# Altium schematic sheet turnRacingMain.SchDoc
size A4; Rules: TODO
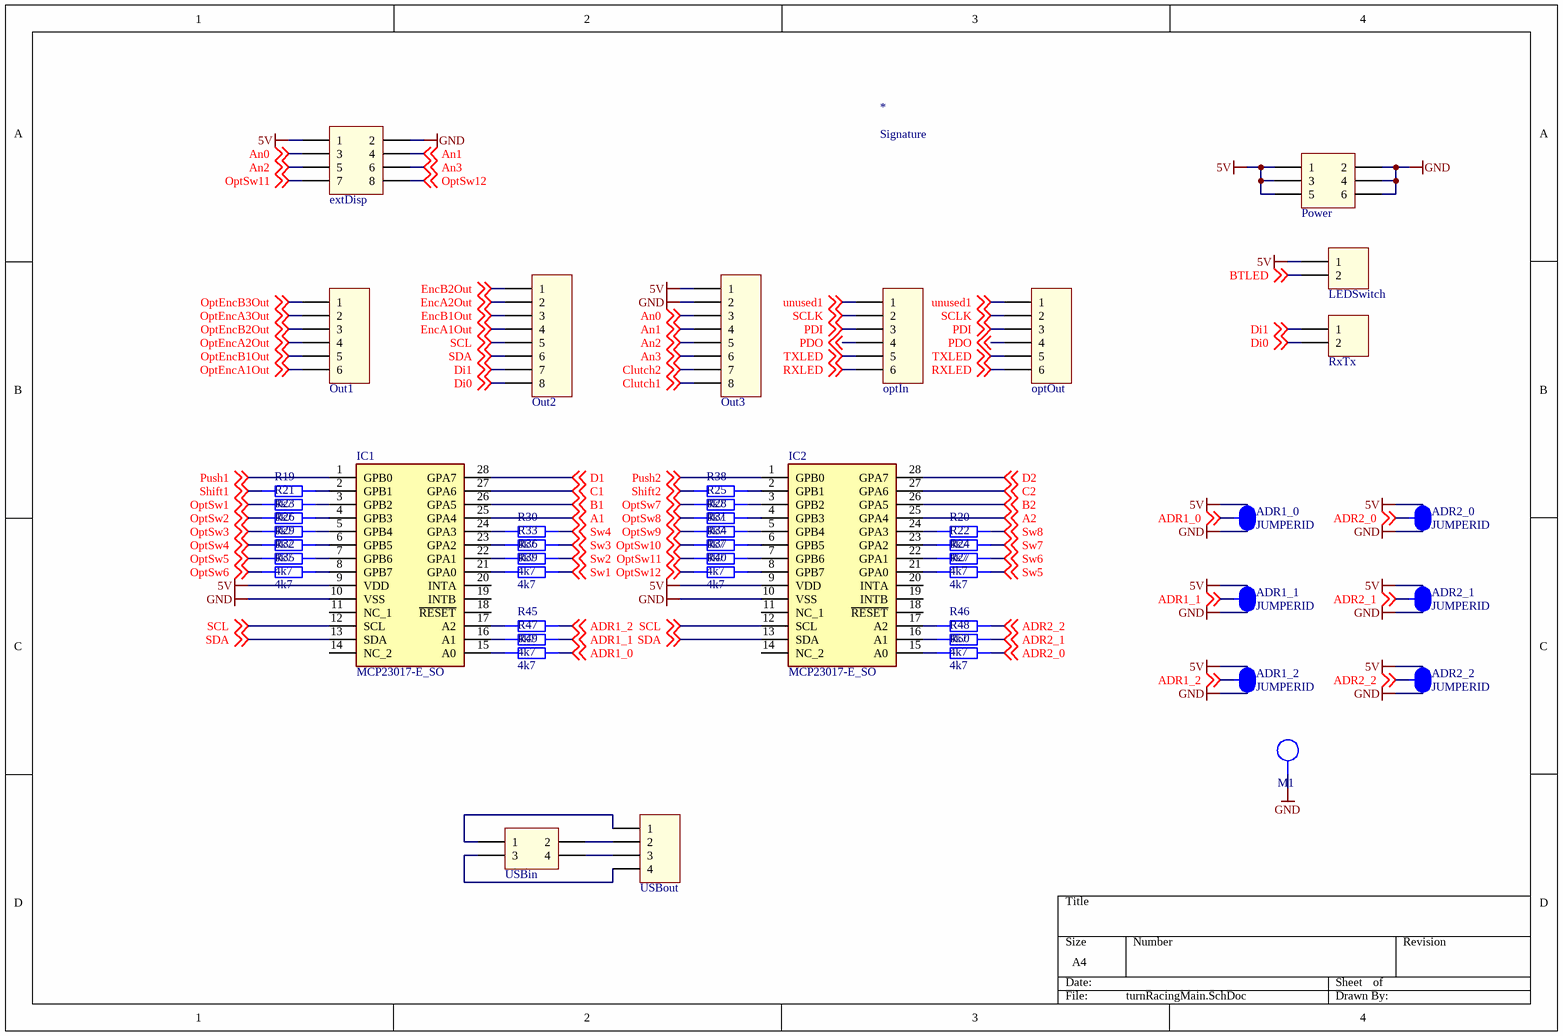
[diagram p0: turnRacingMain.SchDoc]

## Parts
*  Signature  [Signature]
ADR1_0  JUMPERID  [SMD-JUMPER-3]  (net tie, no BOM)
ADR1_1  JUMPERID  [SMD-JUMPER-3]  (net tie, no BOM)
ADR1_2  JUMPERID  [SMD-JUMPER-3]  (net tie, no BOM)
ADR2_0  JUMPERID  [SMD-JUMPER-3]  (net tie, no BOM)
ADR2_1  JUMPERID  [SMD-JUMPER-3]  (net tie, no BOM)
ADR2_2  JUMPERID  [SMD-JUMPER-3]  (net tie, no BOM)
extDisp  61300821121  [61300821121]  (value not drawn)
IC1  MCP23017-E_SO  [SOIC127P1030X265-28N]
IC2  MCP23017-E_SO  [SOIC127P1030X265-28N]
LEDSwitch  61300211121  [61300211121]  (value not drawn)
M1  mounting pad  [MOUNTING_PAD_M3]  (value not drawn)  (no BOM)
optIn  61300611121  [61300611121]  (value not drawn)
optOut  61300611121  [61300611121]  (value not drawn)
Out1  61300611121  [61300611121]  (value not drawn)
Out2  61300811121  [61300811121]  (value not drawn)
Out3  61300811121  [61300811121]  (value not drawn)
Power  61300621121  [61300621121]  (value not drawn)
R19  value 4k7  [STACKPOLE CSR0603]  (hidden comment: SMD Resistor)
R20  value 4k7  [STACKPOLE CSR0603]  (hidden comment: SMD Resistor)
R21  value 4k7  [STACKPOLE CSR0603]  (hidden comment: SMD Resistor)
R22  value 4k7  [STACKPOLE CSR0603]  (hidden comment: SMD Resistor)
R23  value 4k7  [STACKPOLE CSR0603]  (hidden comment: SMD Resistor)
R24  value 4k7  [STACKPOLE CSR0603]  (hidden comment: SMD Resistor)
R25  value 4k7  [STACKPOLE CSR0603]  (hidden comment: SMD Resistor)
R26  value 4k7  [STACKPOLE CSR0603]  (hidden comment: SMD Resistor)
R27  value 4k7  [STACKPOLE CSR0603]  (hidden comment: SMD Resistor)
R28  value 4k7  [STACKPOLE CSR0603]  (hidden comment: SMD Resistor)
R29  value 4k7  [STACKPOLE CSR0603]  (hidden comment: SMD Resistor)
R30  value 4k7  [STACKPOLE CSR0603]  (hidden comment: SMD Resistor)
R31  value 4k7  [STACKPOLE CSR0603]  (hidden comment: SMD Resistor)
R32  value 4k7  [STACKPOLE CSR0603]  (hidden comment: SMD Resistor)
R33  value 4k7  [STACKPOLE CSR0603]  (hidden comment: SMD Resistor)
R34  value 4k7  [STACKPOLE CSR0603]  (hidden comment: SMD Resistor)
R35  value 4k7  [STACKPOLE CSR0603]  (hidden comment: SMD Resistor)
R36  value 4k7  [STACKPOLE CSR0603]  (hidden comment: SMD Resistor)
R37  value 4k7  [STACKPOLE CSR0603]  (hidden comment: SMD Resistor)
R38  value 4k7  [STACKPOLE CSR0603]  (hidden comment: SMD Resistor)
R39  value 4k7  [STACKPOLE CSR0603]  (hidden comment: SMD Resistor)
R40  value 4k7  [STACKPOLE CSR0603]  (hidden comment: SMD Resistor)
R45  value 4k7  [STACKPOLE CSR0603]  (hidden comment: SMD Resistor)
R46  value 4k7  [STACKPOLE CSR0603]  (hidden comment: SMD Resistor)
R47  value 4k7  [STACKPOLE CSR0603]  (hidden comment: SMD Resistor)
R48  value 4k7  [STACKPOLE CSR0603]  (hidden comment: SMD Resistor)
R49  value 4k7  [STACKPOLE CSR0603]  (hidden comment: SMD Resistor)
R50  value 4k7  [STACKPOLE CSR0603]  (hidden comment: SMD Resistor)
RxTx  61300211121  [61300211121]  (value not drawn)
USBin  61300421121  [61300421121]  (value not drawn)
USBout  61300411121  [61300411121]  (value not drawn)

## Nets
5V: ADR1_0.3 ADR1_1.3 ADR1_2.3 ADR2_0.3 ADR2_1.3 ADR2_2.3 extDisp.1 IC1.9(VDD) IC2.9(VDD) LEDSwitch.1 Out3.1 Power.1 Power.3 Power.5
GND: ADR1_0.1 ADR1_1.1 ADR1_2.1 ADR2_0.1 ADR2_1.1 ADR2_2.1 extDisp.2 IC1.10(VSS) IC2.10(VSS) M1.1 Out3.2 Power.2 Power.4 Power.6
A1: IC1.25(GPA4) ; off-sheet A1
A2: IC2.25(GPA4) ; off-sheet A2
ADR1_0: ADR1_0.2 R49.1 ; off-sheet ADR1_0
ADR1_1: ADR1_1.2 R47.1 ; off-sheet ADR1_1
ADR1_2: ADR1_2.2 R45.1 ; off-sheet ADR1_2
ADR2_0: ADR2_0.2 R50.1 ; off-sheet ADR2_0
ADR2_1: ADR2_1.2 R48.1 ; off-sheet ADR2_1
ADR2_2: ADR2_2.2 R46.1 ; off-sheet ADR2_2
An0: extDisp.3 Out3.3 ; off-sheet An0
An1: extDisp.4 Out3.4 ; off-sheet An1
An2: extDisp.5 Out3.5 ; off-sheet An2
An3: extDisp.6 Out3.6 ; off-sheet An3
B1: IC1.26(GPA5) ; off-sheet B1
B2: IC2.26(GPA5) ; off-sheet B2
BTLED: LEDSwitch.2 ; off-sheet BTLED
C1: IC1.27(GPA6) ; off-sheet C1
C2: IC2.27(GPA6) ; off-sheet C2
Clutch1: Out3.8 ; off-sheet Clutch1
Clutch2: Out3.7 ; off-sheet Clutch2
D1: IC1.28(GPA7) ; off-sheet D1
D2: IC2.28(GPA7) ; off-sheet D2
Di0: Out2.8 RxTx.2 ; off-sheet Di0
Di1: Out2.7 RxTx.1 ; off-sheet Di1
EncA1Out: Out2.4 ; off-sheet EncA1Out
EncA2Out: Out2.2 ; off-sheet EncA2Out
EncB1Out: Out2.3 ; off-sheet EncB1Out
EncB2Out: Out2.1 ; off-sheet EncB2Out
OptEncA1Out: Out1.6 ; off-sheet OptEncA1Out
OptEncA2Out: Out1.4 ; off-sheet OptEncA2Out
OptEncA3Out: Out1.2 ; off-sheet OptEncA3Out
OptEncB1Out: Out1.5 ; off-sheet OptEncB1Out
OptEncB2Out: Out1.3 ; off-sheet OptEncB2Out
OptEncB3Out: Out1.1 ; off-sheet OptEncB3Out
OptSw1: R21.2 ; off-sheet OptSw1
OptSw2: R23.2 ; off-sheet OptSw2
OptSw3: R26.2 ; off-sheet OptSw3
OptSw4: R29.2 ; off-sheet OptSw4
OptSw5: R32.2 ; off-sheet OptSw5
OptSw6: R35.2 ; off-sheet OptSw6
OptSw7: R25.2 ; off-sheet OptSw7
OptSw8: R28.2 ; off-sheet OptSw8
OptSw9: R31.2 ; off-sheet OptSw9
OptSw10: R34.2 ; off-sheet OptSw10
OptSw11: extDisp.7 R37.2 ; off-sheet OptSw11
OptSw12: extDisp.8 R40.2 ; off-sheet OptSw12
PDI: optIn.3 optOut.3 ; off-sheet PDI
PDO: optIn.4 optOut.4 ; off-sheet PDO
Push1: IC1.1(GPB0) ; off-sheet Push1
Push2: IC2.1(GPB0) ; off-sheet Push2
RXLED: optIn.6 optOut.6 ; off-sheet RXLED
SCL: IC1.12(SCL) IC2.12(SCL) Out2.5 ; off-sheet SCL
SCLK: optIn.2 optOut.2 ; off-sheet SCLK
SDA: IC1.13(SDA) IC2.13(SDA) Out2.6 ; off-sheet SDA
Shift1: R19.2 ; off-sheet Shift1
Shift2: R38.2 ; off-sheet Shift2
Sw1: R39.1 ; off-sheet Sw1
Sw2: R36.1 ; off-sheet Sw2
Sw3: R33.1 ; off-sheet Sw3
Sw4: R30.1 ; off-sheet Sw4
Sw5: R27.1 ; off-sheet Sw5
Sw6: R24.1 ; off-sheet Sw6
Sw7: R22.1 ; off-sheet Sw7
Sw8: R20.1 ; off-sheet Sw8
TXLED: optIn.5 optOut.5 ; off-sheet TXLED
unused1: optIn.1 optOut.1 ; off-sheet unused1
NetIC1_2: IC1.2(GPB1) R19.1
NetIC1_3: IC1.3(GPB2) R21.1
NetIC1_4: IC1.4(GPB3) R23.1
NetIC1_5: IC1.5(GPB4) R26.1
NetIC1_6: IC1.6(GPB5) R29.1
NetIC1_7: IC1.7(GPB6) R32.1
NetIC1_8: IC1.8(GPB7) R35.1
NetIC1_15: IC1.15(A0) R49.2
NetIC1_16: IC1.16(A1) R47.2
NetIC1_17: IC1.17(A2) R45.2
NetIC1_21: IC1.21(GPA0) R39.2
NetIC1_22: IC1.22(GPA1) R36.2
NetIC1_23: IC1.23(GPA2) R33.2
NetIC1_24: IC1.24(GPA3) R30.2
NetIC2_2: IC2.2(GPB1) R38.1
NetIC2_3: IC2.3(GPB2) R25.1
NetIC2_4: IC2.4(GPB3) R28.1
NetIC2_5: IC2.5(GPB4) R31.1
NetIC2_6: IC2.6(GPB5) R34.1
NetIC2_7: IC2.7(GPB6) R37.1
NetIC2_8: IC2.8(GPB7) R40.1
NetIC2_15: IC2.15(A0) R50.2
NetIC2_16: IC2.16(A1) R48.2
NetIC2_17: IC2.17(A2) R46.2
NetIC2_21: IC2.21(GPA0) R27.2
NetIC2_22: IC2.22(GPA1) R24.2
NetIC2_23: IC2.23(GPA2) R22.2
NetIC2_24: IC2.24(GPA3) R20.2
NetUSBin_1: USBin.1 USBout.1
NetUSBin_2: USBin.2 USBout.2
NetUSBin_3: USBin.3 USBout.4
NetUSBin_4: USBin.4 USBout.3

Not connected (* = marked no-connect by the designer): IC1 11(NC_1) 14(NC_2) 18(~{RESET}) 19(INTB) 20(INTA); IC2 11(NC_1) 14(NC_2) 18(~{RESET}) 19(INTB) 20(INTA)

## Notes on the sheet
- Title:
- Projekt:
- Revision:
- Author:
- Rules:
- Checked by:
- Sheet
- of
- Size:
- A4
- Date:
- Time:

## Library data of the parts
ADR1_0-ADR1_2 ADR2_0-ADR2_2 = SMD Jumper 3
extDisp = 61300821121: WR-PHD 2.54 mm THT Dual Pin Header, 8p; Pin Number: 8; Rated Current: 3 A; Working Voltage: 250 VAC; Withstanding Voltage: 500 VAC; Pitch: 2.54 mm; ComponentLink1Description: Manufacturer; ComponentLink1URL: http://www.we-online.de; ComponentLink2Description: Datasheet; ComponentLink2URL: http://katalog.we-online.de/em/datasheet/6130xx21121.pdf; Part Number: 61300821121; Published Date: Aug 2017; Publisher: Wurth Elektronik
IC1 IC2 = MCP23017-E_SO: Integrated Circuit; Manufacturer_Name: Microchip; Manufacturer_Part_Number: MCP23017-E/SO; Height: 2.65mm
LEDSwitch RxTx = 61300211121: WR-PHD 2.54 mm THT Pin Header, 2p; Pin Number: 2; Rated Current: 3 A; Working Voltage: 250 VAC; Withstanding Voltage: 500 VAC; Pitch: 2.54 mm; ComponentLink1Description: Manufacturer; ComponentLink1URL: http://www.we-online.de; ComponentLink2Description: Datasheet; ComponentLink2URL: http://katalog.we-online.de/em/datasheet/6130xx11121.pdf; Part Number: 61300211121; Published Date: Aug 2017; Publisher: Wurth Elektronik
optIn optOut Out1 = 61300611121: WR-PHD 2.54 mm THT Pin Header, 6p; Pin Number: 6; Rated Current: 3 A; Working Voltage: 250 VAC; Withstanding Voltage: 500 VAC; Pitch: 2.54 mm; ComponentLink1Description: Manufacturer; ComponentLink1URL: http://www.we-online.de; ComponentLink2Description: Datasheet; ComponentLink2URL: http://katalog.we-online.de/em/datasheet/6130xx11121.pdf; Part Number: 61300611121; Published Date: Aug 2017; Publisher: Wurth Elektronik
Out2 Out3 = 61300811121: WR-PHD 2.54 mm THT Pin Header, 8p; Pin Number: 8; Rated Current: 3 A; Working Voltage: 250 VAC; Withstanding Voltage: 500 VAC; Pitch: 2.54 mm; ComponentLink1Description: Manufacturer; ComponentLink1URL: http://www.we-online.de; ComponentLink2Description: Datasheet; ComponentLink2URL: http://katalog.we-online.de/em/datasheet/6130xx11121.pdf; Part Number: 61300811121; Published Date: Aug 2017; Publisher: Wurth Elektronik
Power = 61300621121: WR-PHD 2.54 mm THT Dual Pin Header, 6p; Pin Number: 6; Rated Current: 3 A; Working Voltage: 250 VAC; Withstanding Voltage: 500 VAC; Pitch: 2.54 mm; ComponentLink1Description: Manufacturer; ComponentLink1URL: http://www.we-online.de; ComponentLink2Description: Datasheet; ComponentLink2URL: http://katalog.we-online.de/em/datasheet/6130xx21121.pdf; Part Number: 61300621121; Published Date: Aug 2017; Publisher: Wurth Elektronik
R19-R40 R45-R50 = SMD Resistor: Resistor with multiple footprints
USBin = 61300421121: WR-PHD 2.54 mm THT Dual Pin Header, 4p; Pin Number: 4; Rated Current: 3 A; Working Voltage: 250 VAC; Withstanding Voltage: 500 VAC; Pitch: 2.54 mm; ComponentLink1Description: Manufacturer; ComponentLink1URL: http://www.we-online.de; ComponentLink2Description: Datasheet; ComponentLink2URL: http://katalog.we-online.de/em/datasheet/6130xx21121.pdf; Part Number: 61300421121; Published Date: Aug 2017; Publisher: Wurth Elektronik
USBout = 61300411121: WR-PHD 2.54 mm THT Pin Header, 4p; Pin Number: 4; Rated Current: 3 A; Working Voltage: 250 VAC; Withstanding Voltage: 500 VAC; Pitch: 2.54 mm; ComponentLink1Description: Manufacturer; ComponentLink1URL: http://www.we-online.de; ComponentLink2Description: Datasheet; ComponentLink2URL: http://katalog.we-online.de/em/datasheet/6130xx11121.pdf; Part Number: 61300411121; Published Date: Aug 2017; Publisher: Wurth Elektronik